# EAGLE design CREMA (EAGLE 6.3)
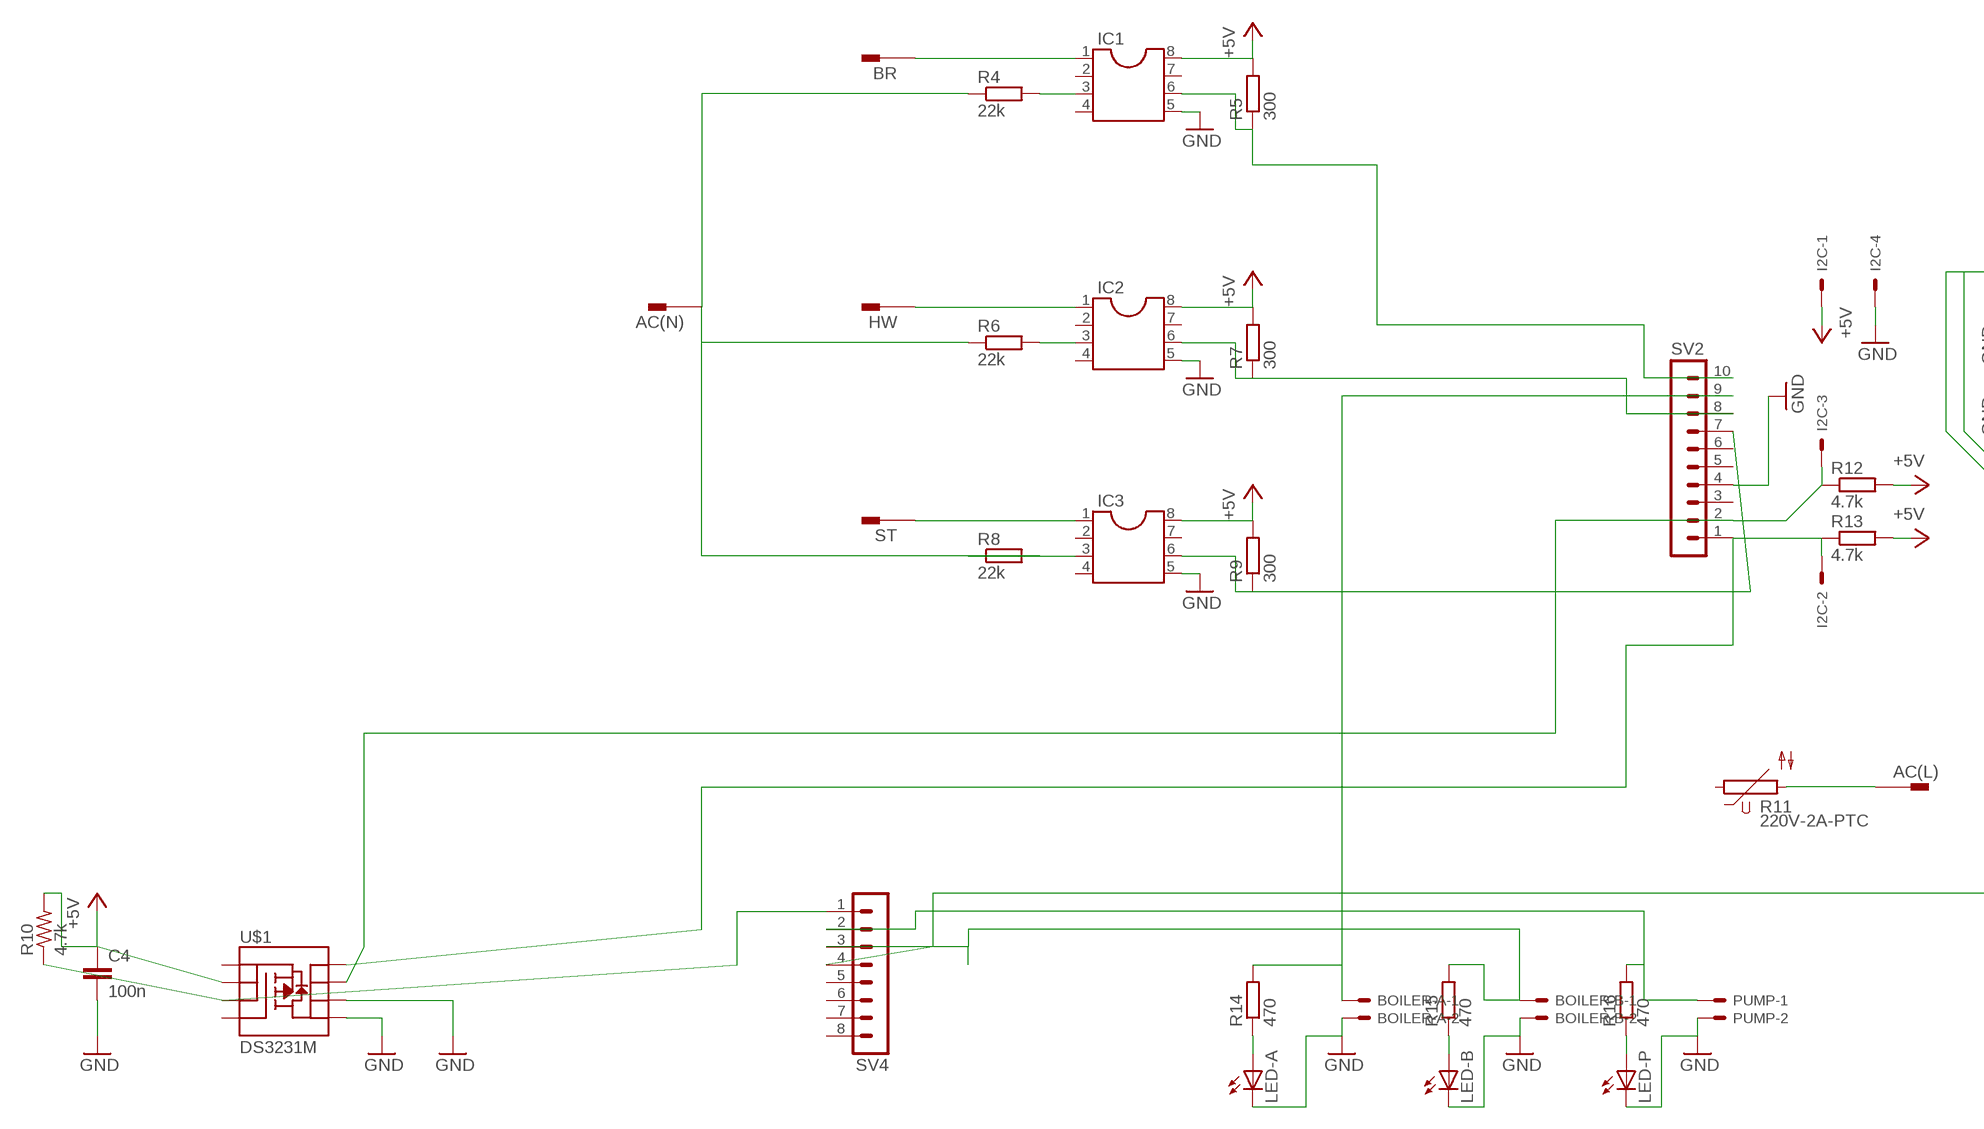
[diagram p0: schematic, sheet 1, part 1 of 2]
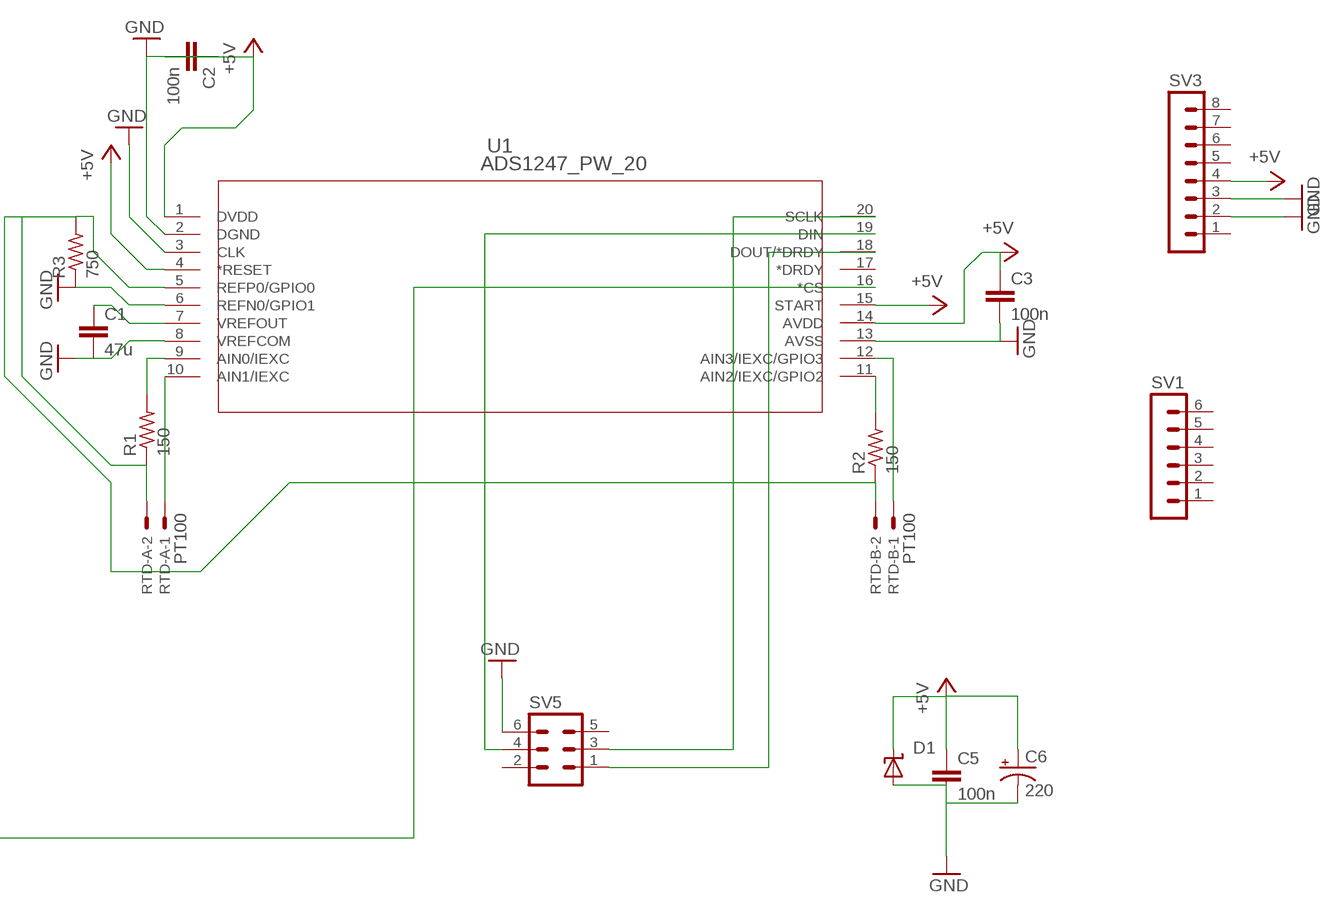
[diagram p1: schematic, sheet 1, part 2 of 2]

## Parts
AC(L)  PIN262409-1  [62409-1]
AC(N)  PIN262409-1  [62409-1]
BOILER-A  C-GRID-02-70543  [70543-02]
BOILER-B  C-GRID-02-70543  [70543-02]
BR  PIN262409-1  [62409-1]
C1  47u  C-EUC0805  [C0805]
C2  100n  C-EUC0805  [C0805]
C3  100n  C-EUC0805  [C0805]
C4  100n  C-EUC0805  [C0805]
C5  100n  C-EUC0805  [C0805]
C6  220  CPOL-USD/7343-31W  [D/7343-31W]
D1  SUPPRESSOR-SMBJ  [SMBJ]
HW  PIN262409-1  [62409-1]
I2C  C-GRID-04-70543  [70543-04]
IC1  DIL8  [DIL08]
IC2  DIL8  [DIL08]
IC3  DIL8  [DIL08]
LED-A  LEDSML0603  [SML0603]
LED-B  LEDSML0603  [SML0603]
LED-P  LEDSML0603  [SML0603]
PUMP  C-GRID-02-70543  [70543-02]
R1  150  R-US_R0603  [R0603]
R2  150  R-US_R0603  [R0603]
R3  750  R-US_R0603  [R0603]
R4  22k  R-EU_R1206  [R1206]
R5  300  R-EU_R1206  [R1206]
R6  22k  R-EU_R1206  [R1206]
R7  300  R-EU_R1206  [R1206]
R8  22k  R-EU_R1206  [R1206]
R9  300  R-EU_R1206  [R1206]
R10  4.7k  R-US_R0603  [R0603]
R11  220V-2A-PTC  S20K11  [S20K11]
R12  4.7k  R-EU_R0603  [R0603]
R13  4.7k  R-EU_R0603  [R0603]
R14  470  R-EU_R0603  [R0603]
R15  470  R-EU_R0603  [R0603]
R16  470  R-EU_R0603  [R0603]
RTD-A  PT100  C-GRID-02-70543  [70543-02]
RTD-B  PT100  C-GRID-02-70543  [70543-02]
ST  PIN262409-1  [62409-1]
SV1  MA06-1  [MA06-1]
SV2  MA10-1  [MA10-1]
SV3  MA08-1  [MA08-1]
SV4  MA08-1  [MA08-1]
SV5  MA03-2  [MA03-2]
U1  ADS1247_PW_20  [PW20]
U$1  DS3231M  MOSFET-PCHANNEL-SOIC8SOIC8  [SO08]

## Nets
+5V: C2.2 C3.1 C4.1 C5.1 C6.+ D1.C I2C.1 IC1.8 IC2.8 IC3.8 R5.2 R7.2 R9.2 R10.2 R12.2 R13.2 SV3.4 U1.1(DVDD) U1.4(*RESET) U1.14(AVDD) U1.15(START) U$1.2(S)
GND: BOILER-A.2 BOILER-B.2 C1.2 C2.1 C3.2 C4.2 C5.2 C6.- D1.A I2C.4 IC1.5 IC2.5 IC3.5 LED-A.C LED-B.C LED-P.C PUMP.2 R3.1 SV2.4 SV3.2 SV3.3 SV5.6 U1.2(DGND) U1.3(CLK) U1.6(REFN0/GPIO1) U1.8(VREFCOM) U1.13(AVSS) U$1.5(D) U$1.6(D)
N$1: I2C.3 R12.1 SV2.2 U$1.7(D)
N$2: C1.1 U1.7(VREFOUT)
N$3: RTD-A.1 U1.10(AIN1/IEXC)
N$4: R1.1 R2.1 R3.2 RTD-A.2 RTD-B.2 U1.5(REFP0/GPIO0)
N$5: R1.2 U1.9(AIN0/IEXC)
N$6: R2.2 U1.11(AIN2/IEXC/GPIO2)
N$8: RTD-B.1 U1.12(AIN3/IEXC/GPIO3)
N$11: BR.A1 BR.A2 IC1.1
N$12: IC1.3 R4.2
N$13: IC1.6 R5.1 SV2.10
N$14: HW.A1 HW.A2 IC2.1
N$15: IC2.3 R6.2
N$16: IC2.6 R7.1 SV2.8
N$17: IC3.1 ST.A1 ST.A2
N$18: IC3.3 R8.1
N$19: IC3.6 R9.1 SV2.7
N$20: AC(N).A1 AC(N).A2 R4.1 R6.1 R8.2
N$23: R10.1 SV4.1 U$1.3(S)
N$24: AC(L).A1 AC(L).A2 R11.2
N$25: LED-A.A R14.1
N$31: SV4.4 U1.16(*CS)
N$33: SV5.1 U1.18(DOUT/*DRDY)
N$34: SV5.3 U1.20(SCLK)
N$35: SV5.4 U1.19(DIN)
N$36: I2C.2 R13.1 SV2.1 U$1.8(D)
N$38: BOILER-A.1 R14.2 SV2.9
N$40: BOILER-B.1 R15.2 SV4.3
N$41: PUMP.1 R16.2 SV4.2
N$51: LED-B.A R15.1
N$53: LED-P.A R16.1
Unconnected: IC1.2 IC1.4 IC1.7 IC2.2 IC2.4 IC2.7 IC3.2 IC3.4 IC3.7 R11.1 SV1.1 SV1.2 SV1.3 SV1.4 SV1.5 SV1.6 SV2.3 SV2.5 SV2.6 SV3.1 SV3.5 SV3.6 SV3.7 SV3.8 SV4.5 SV4.6 SV4.7 SV4.8 SV5.2 SV5.5 U1.17(*DRDY) U$1.1(S) U$1.4(G)

## Library data of the parts
AC(L) AC(N) BR HW ST = con-faston:PIN2: Flachstecker Typ Tyco/Electronics/AMP TAB, FASTON Printed Circuit Board Tabs Source: http://www.buerklin.com, http://catalog.tycoelectronics.com; OC_FARNELL: unknown; OC_NEWARK: unknown
BOILER-A BOILER-B PUMP RTD-A RTD-B = con-molex:C-GRID-02: CONNECTOR wire to board 2.54 mm (0.100") pitch header; OC_FARNELL: unknown; OC_NEWARK: unknown
C1-C5 = rcl:C-EU: CAPACITOR, European symbol
C6 = rcl:CPOL-US: POLARIZED CAPACITOR, American symbol
D1 = diode:SUPPRESSOR-: Suppressor diode
I2C = con-molex:C-GRID-04: CONNECTOR wire to board 2.54 mm (0.100") pitch header; OC_FARNELL: unknown; OC_NEWARK: unknown
IC1-IC3 = ic-package:DIL8: Dual In Line / Socket
LED-A LED-B LED-P = led:LED: LED OSRAM: - CHIPLED LG R971, LG N971, LY N971, LG Q971, LY Q971, LO R971, LY R971 LH N974, LH R974 LS Q976, LO Q976, LY Q976 LO Q996 - Hyper CHIPLED LW Q18S LB Q993, LB Q99A, LB R99A - SideLED LS A670, LO A670, LY A670, LG A670, LP A670 LB A673, LV A673, LT A673, LW A673 LH A674 LY A675 LS A676, LA A676, LO A676, LY A676, LW A676 LS A679, LY A679, LG A679 - Hyper Micro SIDELED® LS Y876, LA Y876, LO Y876, LY Y876 LT Y87S - SmartLED LW L88C, LW L88S LB L89C, LB L89S, LG L890 LS L89K, LO L89K, LY L89K LS L896, LA L896, LO L896, LY L896 - TOPLED LS T670, LO T670, LY T670, LG T670, LP T670 LSG T670, LSP T670, LSY T670, LOP T670, LYG T670 LG T671, LOG T671, LSG T671 LB T673, LV T673, LT T673, LW T673 LH T674 LS T676, LA T676, LO T676, LY T676, LB T676, LH T676, LSB T676, LW T676 LB T67C, LV T67C, LT T67C, LS T67K, LO T67K, LY T67K, LW E67C LS E67B, LA E67B, LO E67B, LY E67B, LB E67C, LV E67C, LT E67C LW T67C LS T679, LY T679, LG T679 LS T770, LO T770, LY T770, LG T770, LP T770 LB T773, LV T773, LT T773, LW T773 LH T774 LS E675, LA E675, LY E675, LS T675 LS T776, LA T776, LO T776, LY T776, LB T776 LHGB T686 LT T68C, LB T68C - Hyper Mini TOPLED® LB M676 - Mini TOPLED Santana® LG M470 LS M47K, LO M47K, LY M47K Source: http://www.osram.convergy.de LUXEON: - LUMILED® LXK2-PW12-R00, LXK2-PW12-S00, LXK2-PW14-U00, LXK2-PW14-V00 LXK2-PM12-R00, LXK2-PM12-S00, LXK2-PM14-U00 LXK2-PE12-Q00, LXK2-PE12-R00, LXK2-PE12-S00, LXK2-PE14-T00, LXK2-PE14-U00 LXK2-PB12-K00, LXK2-PB12-L00, LXK2-PB12-M00, LXK2-PB14-N00, LXK2-PB14-P00, LXK2-PB14-Q00 LXK2-PR12-L00, LXK2-PR12-M00, LXK2-PR14-Q00, LXK2-PR14-R00 LXK2-PD12-Q00, LXK2-PD12-R00, LXK2-PD12-S00 LXK2-PH12-R00, LXK2-PH12-S00 LXK2-PL12-P00, LXK2-PL12-Q00, LXK2-PL12-R00 Source: www.luxeon.com KINGBRIGHT: KA-3528ASYC Source: www.kingbright.com
R1-R3 = rcl:R-US_: RESISTOR, American symbol
R4-R9 R12-R16 = rcl:R-EU_: RESISTOR, European symbol
R10 = resistor:R-US_: RESISTOR, American symbol
R11 = varistor:S20K11: VARISTOR
SV1 = con-lstb:MA06-1: PIN HEADER; OC_FARNELL: unknown; OC_NEWARK: unknown
SV2 = con-lstb:MA10-1: PIN HEADER; OC_FARNELL: unknown; OC_NEWARK: unknown
SV3 SV4 = con-lstb:MA08-1: PIN HEADER; OC_FARNELL: unknown; OC_NEWARK: unknown
SV5 = con-lstb:MA03-2: PIN HEADER; OC_FARNELL: unknown; OC_NEWARK: unknown
U1 = ADS1247:ADS1247_PW_20; DATASHEETURL: http://www.ti.com/lit/gpn/ADS1247; DESCRIPTION: Low Noise, Precision 24-Bit Analog-to-Digital Converter; FAMILY_NAME: PRECISION ADC (<=10MSPS); GENERIC_PART_NUMBER: ADS1247; INDUSTRY_STD_PKG_TYPE: TSSOP; MANUFACTURER: Texas Instruments; PACKAGE_DESIGNATOR: PW; PIN_COUNT: 20
U$1 = SparkFun-DiscreteSemi:MOSFET-PCHANNEL-SOIC8: Generic 8-pin PMOSFET

## Board
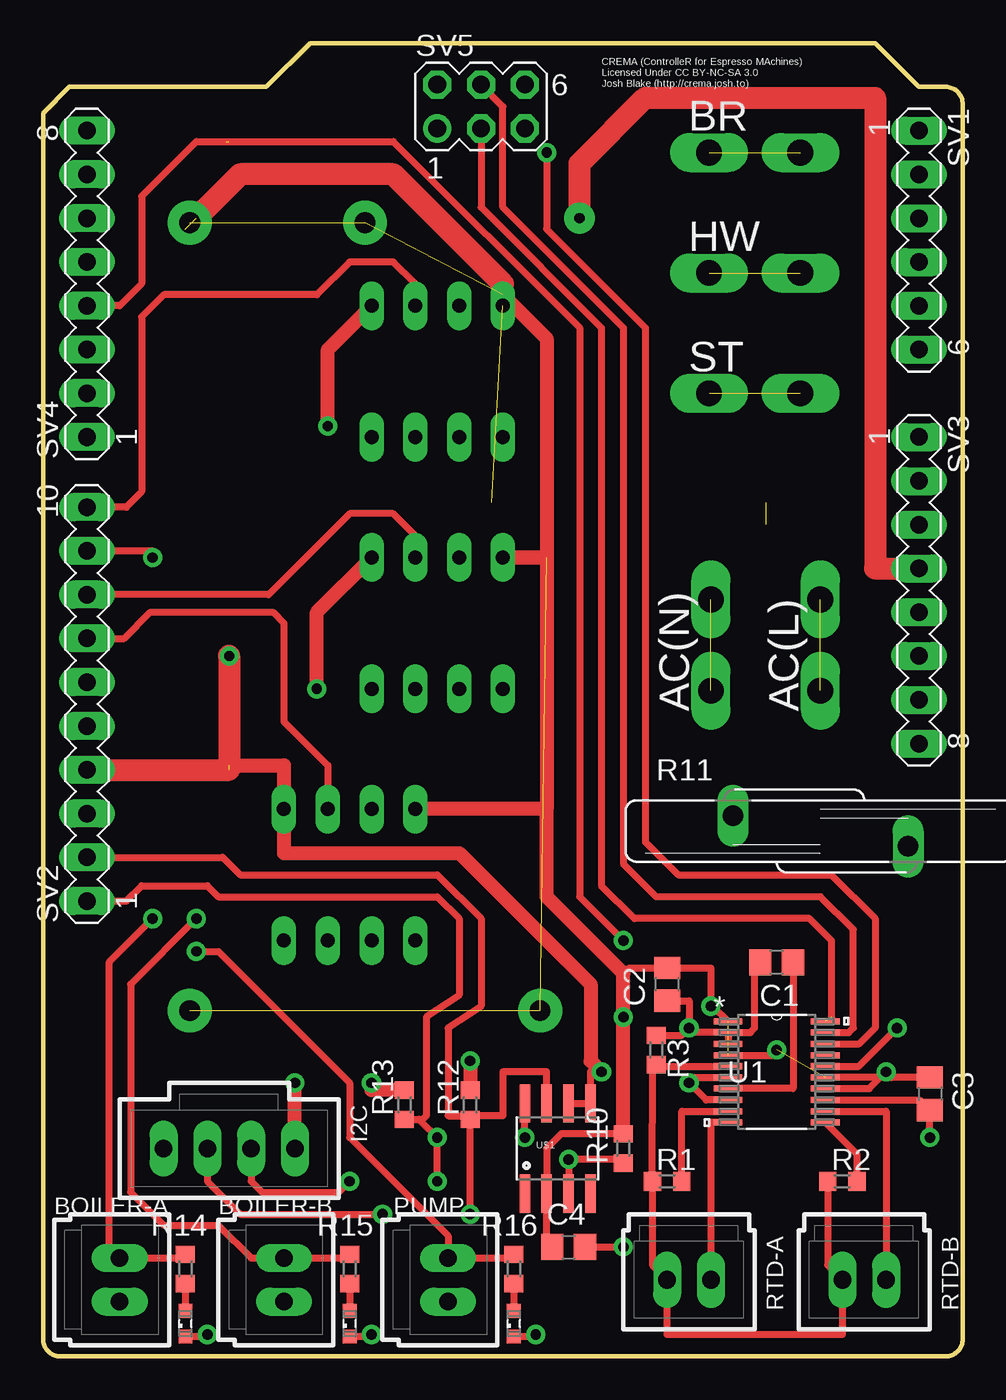
[diagram p2: board, top side]
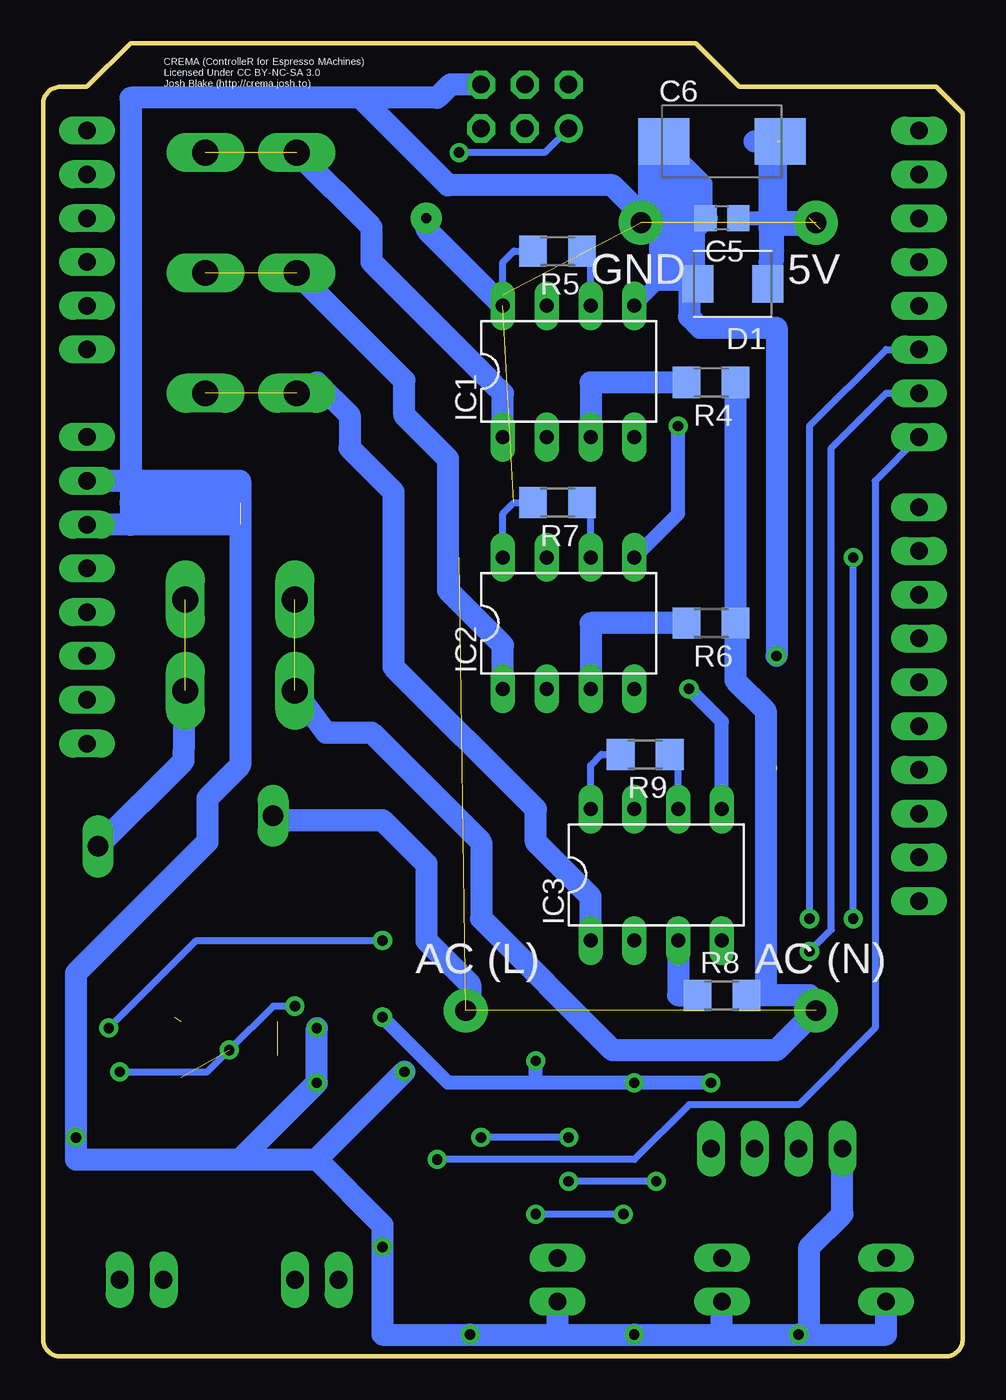
[diagram p3: board, bottom side, seen from below]

Size 53.34 x 76.2 mm. Coordinates in mm from the lower left corner, seen from the top.
Outline: 0,72.14 1.52,73.66 12.95,73.66 15.49,76.2 48.26,76.2 50.8,73.66 52.34,73.66 arc-90 53.34,72.66 53.34,1 arc-90 52.34,0 1,0 arc-90 0,1 0,72.14
Copper layers (1*16): Top 0.035mm / dielectric 1.5mm / Bottom 0.035mm
Design rules: minimum track width 8mil, minimum drill 20mil, track to track 8mil, track to pad 8mil, pad to pad 8mil, via to via 8mil, smd to smd 8mil, copper to edge 10mil, drill to drill 8mil, minimum pad ring 12mil, minimum via ring 10mil, stop-mask expansion 4mil, vias tented up to drill 25mil, thermal gap 10mil
tKeepout: area 4.4,16.5 to 33,69.8

### Footprints (pad centres in the part's own frame; a part is rotated, then mirrored left to right if it is on the bottom)
62409-1 = drill 1.5 pad 1.9 long: A1 -2.65,0; A2 2.65,0
70543-02 = drill 1.016 long: 1 -1.27,0; 2 1.27,0
C0805 = smd 1.3 x 1.5: 1 -0.95,0; 2 0.95,0
D/7343-31W = smd 2.95 x 2.7: + 3.375,0; - -3.375,0
SMBJ = smd 1.78 x 2.16: A 2.04,0; C -2.03,0
70543-04 = drill 1.016 long: 1 -3.81,0; 2 -1.27,0; 3 1.27,0; 4 3.81,0
DIL08 = drill 0.813 long: 1 -3.81,-3.81; 2 -1.27,-3.81; 3 1.27,-3.81; 4 3.81,-3.81; 5 3.81,3.81; 6 1.27,3.81; 7 -1.27,3.81; 8 -3.81,3.81
SML0603 = smd 0.8 x 0.8: A 0.75,0; C -0.75,0
R0603 = smd 1 x 1.1: 1 -0.85,0; 2 0.85,0
R1206 = smd 1.6 x 1.803: 1 -1.422,0; 2 1.422,0
S20K11 = drill 1.194 long: 1 -0.889,-5.08; 2 0.889,5.08
MA06-1 = drill 1.016 long: 1 -6.35,0; 2 -3.81,0; 3 -1.27,0; 4 1.27,0; 5 3.81,0; 6 6.35,0
MA10-1 = drill 1.016 long: 1 -11.43,0; 2 -8.89,0; 3 -6.35,0; 4 -3.81,0; 5 -1.27,0; 6 1.27,0; 7 3.81,0; 8 6.35,0; 9 8.89,0; 10 11.43,0
MA08-1 = drill 1.016 long: 1 -8.89,0; 2 -6.35,0; 3 -3.81,0; 4 -1.27,0; 5 1.27,0; 6 3.81,0; 7 6.35,0; 8 8.89,0
MA03-2 = drill 1.016: 1 -2.54,-1.27 | drill 1.016 octagon: 2 -2.54,1.27; 3 0,-1.27; 4 0,1.27; 5 2.54,-1.27; 6 2.54,1.27
PW20 = smd 1.676 x 0.356: 1 -2.819,2.921; 2 -2.819,2.286; 3 -2.819,1.626; 4 -2.819,0.965; 5 -2.819,0.33; 6 -2.819,-0.33; 7 -2.819,-0.965; 8 -2.819,-1.626; 9 -2.819,-2.286; 10 -2.819,-2.921; 11 2.819,-2.921; 12 2.819,-2.286; 13 2.819,-1.626; 14 2.819,-0.965; 15 2.819,-0.33; 16 2.819,0.33; 17 2.819,0.965; 18 2.819,1.626; 19 2.819,2.286; 20 2.819,2.921
SO08 = smd 0.61 x 2.21: 1 -1.905,-2.616; 2 -0.635,-2.616; 3 0.635,-2.616; 4 1.905,-2.616; 5 1.905,2.616; 6 0.635,2.616; 7 -0.635,2.616; 8 -1.905,2.616

### Placement (x,y rotation side)
AC(L)  45.08,41.27 90 top
AC(N)  38.73,41.27 90 top
BOILER-A  4.44,4.45 270 top
BOILER-B  13.97,4.45 270 top
BR  41.27,69.85 0 top
C1  42.55,22.86 180 top
C2  36.19,21.59 90 top
C3  51.44,15.24 270 top
C4  30.48,6.35 0 top
C5  13.97,66.04 180 bottom
C6  13.97,70.48 0 bottom
D1  13.33,62.23 180 bottom
HW  41.27,62.87 0 top
I2C  10.79,12.06 180 top
IC1  22.86,57.15 0 bottom
IC2  22.86,42.55 0 bottom
IC3  17.78,27.94 0 bottom
LED-A  8.25,1.91 90 top
LED-B  17.78,1.91 90 top
LED-P  27.3,1.91 90 top
PUMP  23.5,4.45 270 top
R1  36.19,10.16 0 top
R2  46.35,10.16 0 top
R3  35.56,17.78 270 top
R4  14.61,56.52 180 bottom
R5  23.5,64.14 180 bottom
R6  14.61,42.55 180 bottom
R7  23.5,49.53 180 bottom
R8  13.97,20.95 0 bottom
R9  18.42,34.92 180 bottom
R10  33.66,12.06 90 top
R11  45.08,30.48 270 top
R12  24.76,14.61 90 top
R13  20.96,14.61 90 top
R14  8.25,5.08 90 top
R15  17.78,5.08 90 top
R16  27.3,5.08 90 top
RTD-A  37.46,4.45 180 top
RTD-B  47.62,4.45 180 top
ST  41.27,55.88 0 top
SV1  50.8,64.77 270 top
SV2  2.54,37.85 90 top
SV3  50.8,44.45 270 top
SV4  2.54,62.23 90 top
SV5  25.4,72.52 0 top
U1  42.55,16.51 0 top
U$1  29.85,12.06 0 top

### Tracks (layer width: path | path; a pad name or v marks a point on that pad's centre or on a via)
+5V  (via drill 0.6, 0.6 pad 1.78)  (5 unrouted)
  Top 0.406: U1.4 42.24,17.48 arc90 42.55,17.78 | C3.1 49.21,16.19 48.89,16.51 48.56,16.18 | 48.56,16.18 U1.15 | U1.14 47.93,15.54 48.56,16.18 | C4.1 29.21,6.67 U$1.2 29.21,12.06 30.06,12.91 R10.2 | 33.66,22.23 33.97,22.54 C2.2 38.73,22.54 38.73,20.32 38.84,20.32 U1.1
  Top 0.813: IC2.8 29.21,46.35 29.21,31.75 | 29.21,31.75 IC3.8 | 29.21,31.75 29.21,26.67 33.66,22.23 v33.66,19.68 R10.2 | R13.2 19.05,15.46 v19.05,15.88 | v24.76,17.14 R12.2 | I2C.1 v14.61,15.88 | IC1.8 26.67,61.59
  Top 1.27: v31.11,66.04 31.11,69.22 34.92,73.03 48.26,73.03 48.26,45.72 SV3.4 | IC1.8 26.67,62.23 20.32,68.58 11.43,68.58 8.25,65.41
  Bottom 0.406: IC2.8 26.67,48.9 26.04,49.53 R7.2 | IC1.8 26.67,63.5 26.04,64.14 R5.2 | IC3.8 21.59,34.29 20.96,34.92 R9.2
  Bottom 0.813: 24.76,15.88 v19.05,15.88 v14.61,15.88 | 24.76,15.88 v24.76,17.14 | 24.76,15.88 29.85,15.88 v33.66,19.68 | D1.C 11.3,66.04 | C5.1 11.3,66.04 | 10.6,66.04 C6.+ | 8.89,66.04 10.6,66.04 | 10.6,66.04 11.3,66.04
  Bottom 1.27: 10.79,70.48 12.07,70.48 | v31.11,66.04 31.11,65.41 IC1.8
GND  (via drill 0.6)  (2 unrouted)
  Top 0.406: U1.2 41.02,18.8 41.27,19.05 41.27,22.54 C1.2 | U1.2 U1.3 | U1.13 50.84,14.88 C3.2 v51.44,12.7 | U$1.6 U$1.5 31.75,16.51 v32.39,16.51 | C2.1 37.46,20.64 v37.46,19.05 | U1.2 37.72,18.8 v37.46,19.05 | R3.1 37.05,18.63 v37.46,19.05 | U1.6 37.77,16.18 v37.46,15.88 38.46,14.88 U1.8 | C4.2 v33.66,6.35 | LED-A.C 9.41,1.16 v9.53,1.27 | LED-B.C 18.93,1.16 v19.05,1.27 | LED-P.C 28.46,1.16 v28.57,1.27
  Top 0.813: v15.87,38.73 15.87,43.18 IC2.5 | v16.51,53.98 16.51,58.42 IC1.5 | 10.79,34.29 13.97,34.29 IC3.5 13.97,29.21 24.13,29.21 31.75,21.59 31.75,17.14 v32.39,16.51
  Top 1.27: SV2.4 10.79,34.04
  Bottom 0.813: C6.- 14.92,68.06 C5.2 14.61,66.04 15.37,65.27 D1.A 16.51,62.23 | IC1.5 17.78,62.23 | 17.78,62.23 16.51,62.23 | IC3.5 13.97,36.83 v15.87,38.73 | IC2.5 16.51,48.9 v16.51,53.98 | 15.87,62.87 15.87,67.31 15.24,67.31 17.14,69.22 17.14,67.94 | 17.14,67.94 16.51,67.31 16.51,62.23 | 17.78,62.23 17.78,64.77 | 17.78,64.77 18.42,65.41 18.42,66.04 18.42,69.22 17.14,70.48 | 17.78,68.58 17.78,64.77 | 17.14,67.94 17.14,62.87
  Bottom 1.27: SV5.6 29.72,73.79 30.48,73.03 34.92,73.03 | 34.92,73.03 48.26,73.03 48.26,49.53 | 48.26,49.53 48.26,48.26 | SV3.2 41.91,50.8 41.91,49.53 | 41.91,48.26 SV3.3 | 41.91,49.53 41.91,34.29 43.81,32.38 43.81,29.84 51.44,22.23 v51.44,12.7 51.44,11.43 41.91,11.43 | 41.91,11.43 v37.46,15.88 v37.46,19.05 | 37.46,11.43 v32.39,16.51 | 41.91,11.43 37.46,11.43 | 37.46,11.43 33.66,7.62 v33.66,6.35 33.66,1.27 v28.57,1.27 23.5,1.27 | 23.5,1.27 PUMP.2 | 23.5,1.27 v19.05,1.27 13.97,1.27 | 13.97,1.27 BOILER-B.2 | 13.97,1.27 v9.53,1.27 8.89,1.27 | 8.89,1.27 4.44,1.27 BOILER-A.2 | 8.89,1.27 8.89,6.35 6.99,8.26 I2C.4 | 18.42,66.04 20.32,67.94 29.85,67.94 34.92,73.03 | 41.91,49.53 48.26,49.53
  Bottom 1.676: 15.87,67.31 17.78,69.22
N$1  (via drill 0.6)
  Top 0.406: U$1.7 29.21,16.51 26.67,16.51 26.67,13.97 24.76,13.97 | 24.76,13.97 23.5,13.97 23.5,19.05 25.4,20.32 25.4,25.4 22.86,27.94 11.43,27.94 10.41,28.96 SV2.2 | 24.76,13.97 R12.1 v24.76,8.26 | I2C.3 9.53,10.16 11.43,8.26 v19.68,8.26
  Bottom 0.406: v19.68,8.26 v24.76,8.26
N$2
  Top 0.406: C1.1 43.49,15.54 U1.7
N$3
  Top 0.406: U1.10 38.73,13.59 RTD-A.1
N$4
  Top 0.406: U1.5 35.65,16.84 R3.2 35.35,16.93 R1.1 35.34,5.29 RTD-A.2 36.19,1.27 46.35,1.27 RTD-B.2 45.5,5.29 R2.1
N$5
  Top 0.406: R1.2 37.05,14.22 U1.9
N$6
  Top 0.406: U1.11 47.2,11.75 R2.2
N$7  (via drill 0.6)
  Bottom 0.406: v38.73,20.32 40,20.32 v42.55,17.78 43.81,16.51 v48.89,16.51
N$8
  Top 0.406: U1.12 48.89,14.22 RTD-B.1
N$11  (1 unrouted)
  Bottom 1.27: BR.A1 34.29,65.52 34.29,63.5 27.62,56.83 27.3,56.52 26.67,55.88 IC1.1
N$12
  Bottom 1.27: R4.2 21.59,56.52 IC1.3
N$13
  Top 0.406: IC1.6 21.59,62.23 20.32,63.5 17.78,63.5 15.87,61.59 6.99,61.59 5.71,60.33 5.71,50.16 4.83,49.28 SV2.10
  Bottom 0.406: IC1.6 21.59,64.29 R5.1
N$14  (1 unrouted)
  Bottom 1.27: HW.A1 32.39,56.62 32.39,54.61 29.85,52.07 29.85,44.45 26.67,41.27 IC2.1
N$15
  Bottom 1.27: R6.2 21.59,42.55 IC2.3
N$16
  Top 0.406: IC2.6 21.59,47.62 20.32,48.9 17.78,48.9 13.08,44.2 SV2.8
  Bottom 0.406: IC2.6 21.59,49.05 R7.1
N$17  (1 unrouted)
  Bottom 1.27: ST.A1 37.46,56.52 35.56,54.61 35.56,52.7 33.02,50.16 33.02,40.01 24.76,31.75 24.76,29.84 21.59,26.67 IC3.1
N$18
  Bottom 1.27: IC3.3 16.51,20.95 R8.1
N$19
  Top 0.406: IC3.6 16.51,34.29 13.97,36.83 13.97,42.55 13.33,43.18 6.22,43.18 4.7,41.66 SV2.7
  Bottom 0.406: IC3.6 16.51,34.44 R9.1
N$20  (1 unrouted)
  Bottom 1.27: R4.1 R6.1 13.18,39.22 11.43,37.47 11.43,20.95 | 11.43,20.95 R8.2 | AC(N).A1 36.94,36.2 34.29,36.2 27.94,29.84 27.94,25.4 20.32,17.78 10.79,17.78 8.25,20.32 8.89,20.95 11.43,20.95
N$23  (via drill 0.6)
  Top 0.406: R10.1 33.44,11.43 v30.48,11.43 U$1.3
  Bottom 0.406: SV4.1 5.08,50.8 5.08,19.05 9.53,14.61 15.87,14.61 19.05,11.43 v30.48,11.43
N$24  (1 unrouted)
  Bottom 1.27: R11.2 45.19,34.56 AC(L).A1
N$25
  Top 0.406: R14.1 LED-A.A
N$31  (via drill 0.6)
  Top 0.406: U1.16 47.32,16.84 v49.53,19.05 | v33.66,24.13 31.11,26.67 31.11,59.69 20.32,70.48 8.89,70.48 5.71,67.31 5.71,62.23 4.44,60.96 SV4.4
  Bottom 0.406: v49.53,19.05 44.45,24.13 v33.66,24.13
N$32
  Bottom 1.27: 40,31.11 33.66,31.11 31.11,28.57 31.11,24.13 28.57,21.59 28.57,19.68
N$33  (via drill 0.6)
  Top 0.406: v29.21,69.85 29.21,65.41 34.92,59.69 34.92,29.84 36.83,27.94 45.72,27.94 48.26,25.4 48.26,19.05 47.35,18.14 U1.18
  Bottom 0.406: SV5.1 24.26,69.85 v29.21,69.85
N$34  (1 unrouted)
  Top 0.406: SV5.3 25.4,66.67 32.39,59.69 32.39,27.3 34.29,25.4 44.45,25.4 45.72,24.13 45.72,19.68
N$35
  Top 0.406: 25.53,73.79 SV5.4 26.67,72.52 26.67,66.67 33.66,59.69 33.66,28.57 35.56,26.67 45.08,26.67 46.99,24.77 46.99,19.05 46.74,18.8 U1.19
N$36  (via drill 0.6)
  Top 0.406: R13.1 21.8,13.76 21.91,13.65 | 21.91,13.65 v22.86,12.7 v22.86,10.16 | v27.94,12.7 U$1.8 | SV2.1 4.83,26.42 5.71,27.3 9.53,27.3 10.16,26.67 22.86,26.67 24.13,25.4 24.13,20.95 22.22,19.68 22.22,13.97 21.91,13.65 | I2C.2 12.07,10.16 12.7,9.53 17.14,9.53 v17.78,10.16
  Bottom 0.406: v22.86,12.7 v27.94,12.7 | v17.78,10.16 v22.86,10.16
N$38  (via drill 0.6)
  Top 0.406: v6.35,46.35 6.35,46.74 SV2.9 | v6.35,25.4 3.81,22.86 3.81,6.35 BOILER-A.1 8.04,5.71 R14.2
  Bottom 0.406: v6.35,25.4 v6.35,46.35
N$39  (via drill 0.6)
  other vias: 27.94,12.7
N$40  (via drill 0.6)
  Top 0.406: v8.89,25.4 5.08,21.59 5.08,9.53 6.99,7.62 10.16,7.62 12.07,5.71 BOILER-B.1 17.57,5.71 R15.2
  Bottom 0.406: v8.89,25.4 8.89,53.98 4.44,58.42 SV4.3
N$41  (via drill 0.6)
  Top 0.406: v8.89,23.5 10.16,23.5 17.78,15.88 17.78,12.7 23.5,6.99 PUMP.1 27.09,5.71 R16.2
  Bottom 0.406: v8.89,23.5 7.62,24.77 7.62,52.7 4.44,55.88 SV4.2
N$46  (via drill 0.6)
  other vias: 37.46,19.05
N$47
  Bottom 0.813: 8.89,65.41 10.79,65.41 | 10.79,65.41 11.43,65.41 | 11.43,65.41 11.43,63.5 | 11.43,65.41 11.43,69.22 | 10.79,65.41 10.79,63.5 | 10.79,69.22 10.79,65.41
N$49  (via drill 0.6)
  Top 1.27: v10.79,40.64 10.79,34.29
  Bottom 1.27: 15.87,62.87 15.87,60.33 15.24,59.69 10.79,59.69 v10.79,40.64
N$51
  Top 0.406: R15.1 LED-B.A
N$53
  Top 0.406: R16.1 LED-P.A
N$102  (via drill 1.2 pad 2.54)  (4 unrouted)
  Top 0.813: 26.67,46.35 29.21,46.35 29.21,59.05 26.67,61.59
  other vias: 8.51,20.07 28.83,20.07 8.51,65.79 18.67,65.79

### Text on the board
tNames: CREMA (ControlleR for Espresso MAchines) | Josh Blake (http://crema.josh.to) | Licensed Under CC BY-NC-SA 3.0
bNames: CREMA (ControlleR for Espresso MAchines) | Josh Blake (http://crema.josh.to) | Licensed Under CC BY-NC-SA 3.0 | 5V | GND | AC (N) | AC (L)